# EAGLE schematic lesion-256 (EAGLE 8.3.2)
DESIGNER: JON NEWMAN; DESIGN_NAME: lesion-128-256; LICENSE: CERN OHL v1.2; REVISION: 1.0
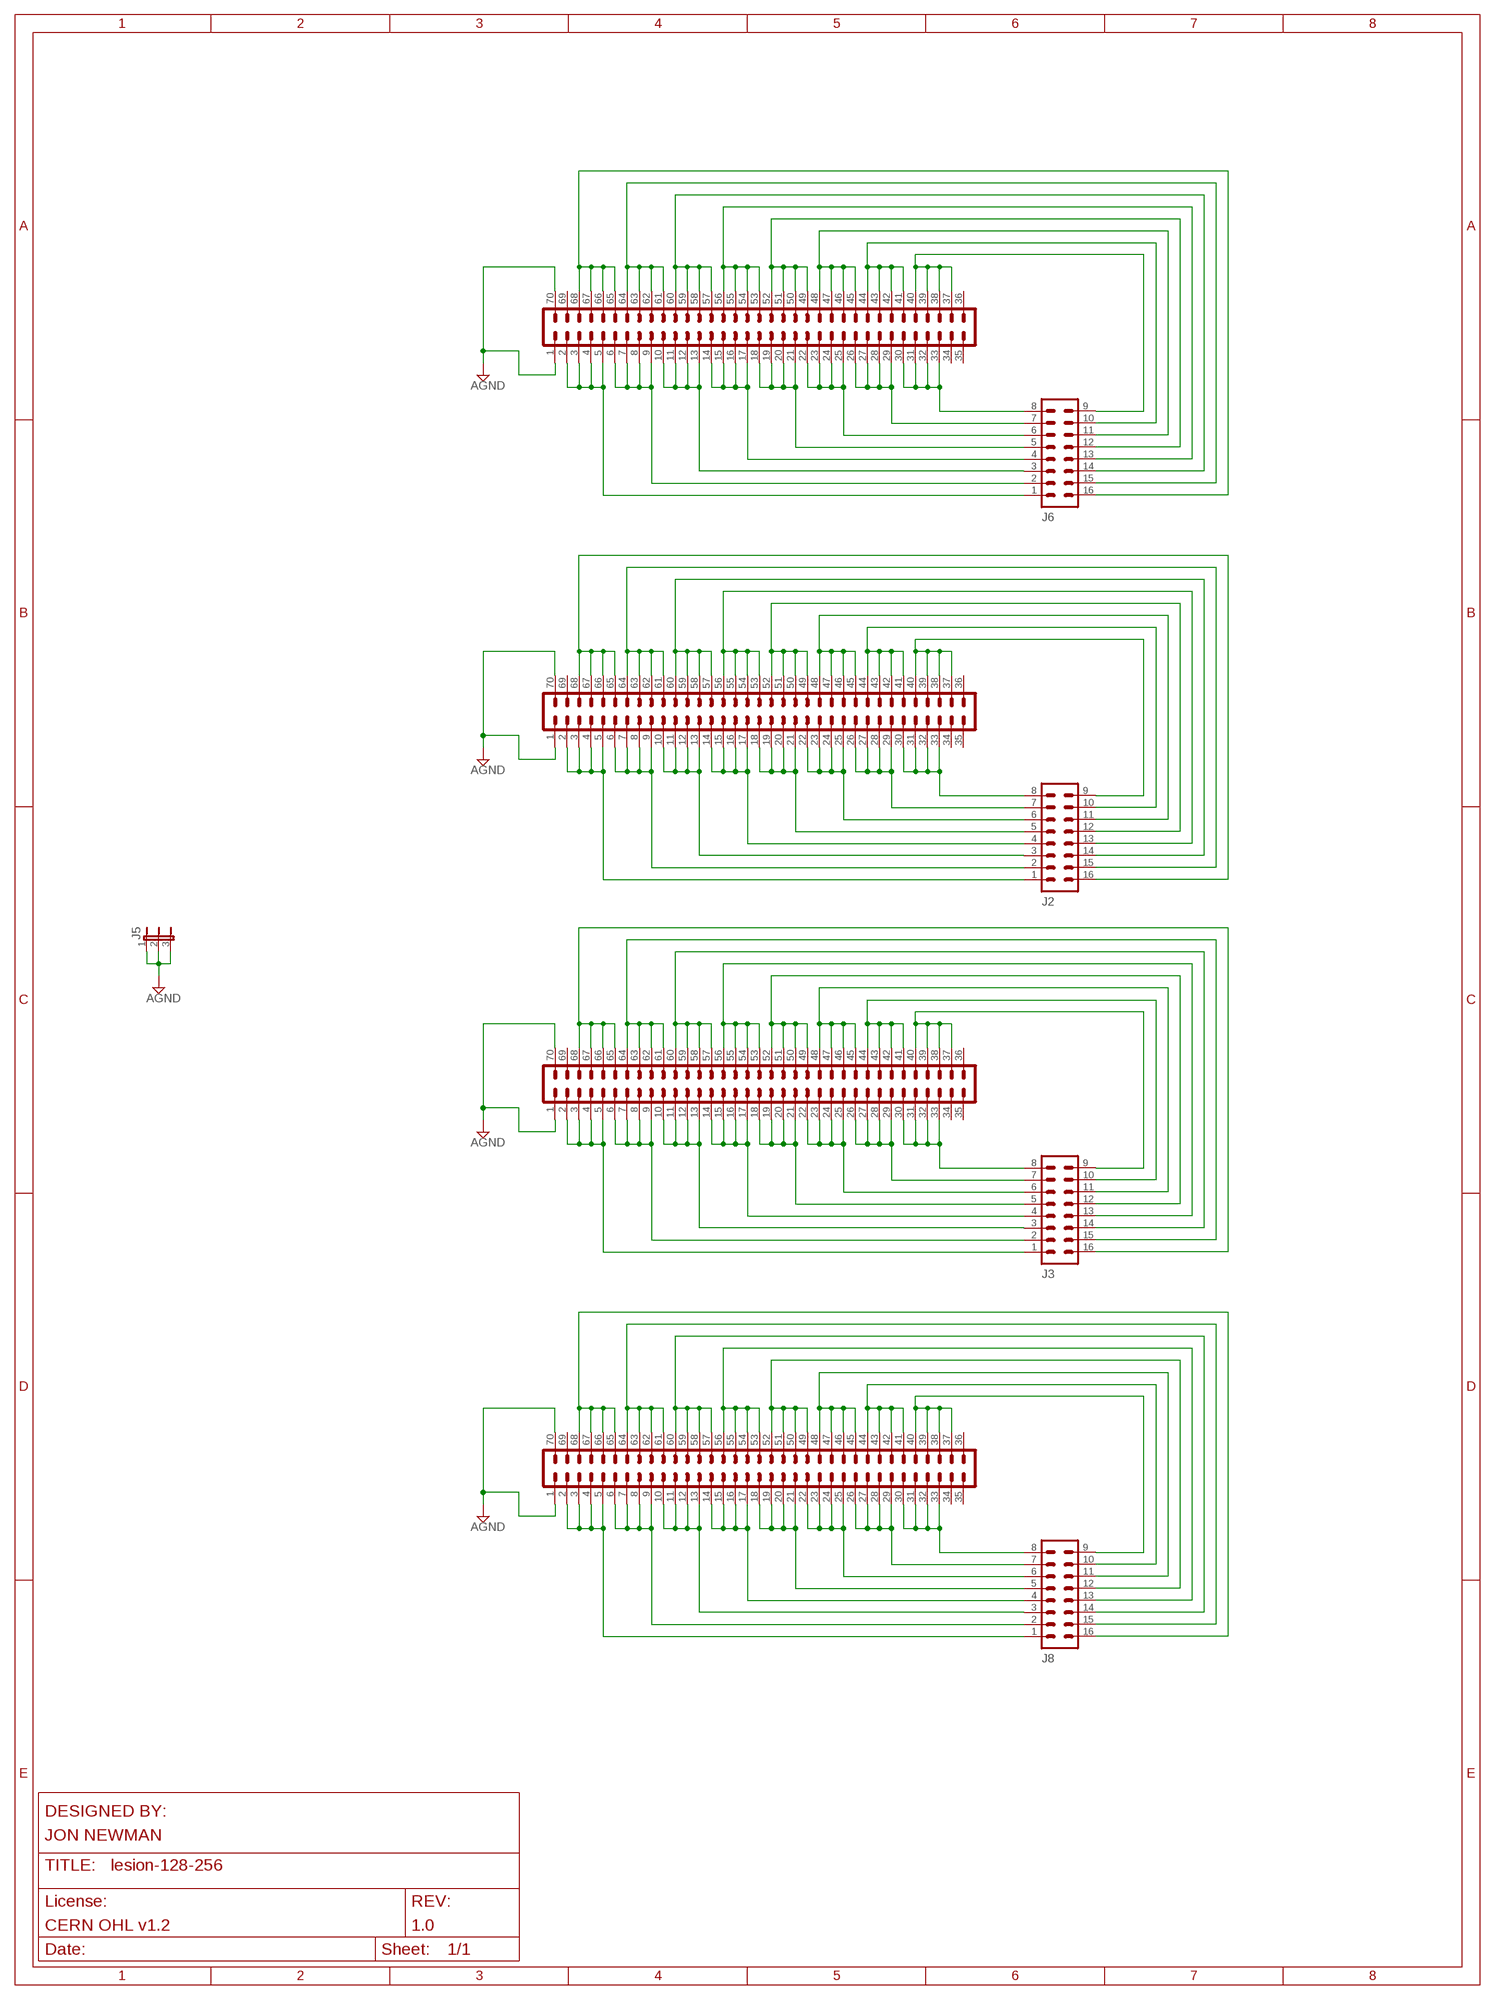
[diagram p0: schematic, sheet 1, part 1 of 2]
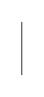
[diagram p1: schematic, sheet 1, part 2 of 2]

## Parts
J2  PINHD-2X8_SMD_0.5"  [JP2X8_SMD_0.5"]
J3  PINHD-2X8_SMD_0.5"  [JP2X8_SMD_0.5"]
J5  JP3E_SMD-0.05  [JP3_SMD-0.05]
J6  PINHD-2X8_SMD_0.5"  [JP2X8_SMD_0.5"]
J8  PINHD-2X8_SMD_0.5"  [JP2X8_SMD_0.5"]
JA1  DF40C(2.0)-70DS-0.4V(51)  PINHD-2X35_DF40REC  [DF40-70REC]
JA3  DF40C(2.0)-70DS-0.4V(51)  PINHD-2X35_DF40REC  [DF40-70REC]
JA5  DF40C(2.0)-70DS-0.4V(51)  PINHD-2X35_DF40REC  [DF40-70REC]
JA7  DF40C(2.0)-70DS-0.4V(51)  PINHD-2X35_DF40REC  [DF40-70REC]

## Nets
AGND: J5.1 J5.2 J5.3 JA1.1 JA1.70 JA3.1 JA3.70 JA5.1 JA5.70 JA7.1 JA7.70
N$16: J2.1 JA1.2 JA1.3 JA1.4 JA1.5
N$17: J2.2 JA1.6 JA1.7 JA1.8 JA1.9
N$18: J2.3 JA1.10 JA1.11 JA1.12 JA1.13
N$19: J2.4 JA1.14 JA1.15 JA1.16 JA1.17
N$20: J2.5 JA1.18 JA1.19 JA1.20 JA1.21
N$21: J2.6 JA1.22 JA1.23 JA1.24 JA1.25
N$22: J2.7 JA1.26 JA1.27 JA1.28 JA1.29
N$23: J2.8 JA1.30 JA1.31 JA1.32 JA1.33
N$24: J2.9 JA1.37 JA1.38 JA1.39 JA1.40
N$25: J2.10 JA1.41 JA1.42 JA1.43 JA1.44
N$26: J2.11 JA1.45 JA1.46 JA1.47 JA1.48
N$27: J2.12 JA1.49 JA1.50 JA1.51 JA1.52
N$28: J2.13 JA1.53 JA1.54 JA1.55 JA1.56
N$29: J2.14 JA1.57 JA1.58 JA1.59 JA1.60
N$30: J2.15 JA1.61 JA1.62 JA1.63 JA1.64
N$31: J2.16 JA1.65 JA1.66 JA1.67 JA1.68
N$33: J3.1 JA3.2 JA3.3 JA3.4 JA3.5
N$34: J3.2 JA3.6 JA3.7 JA3.8 JA3.9
N$35: J3.3 JA3.10 JA3.11 JA3.12 JA3.13
N$36: J3.4 JA3.14 JA3.15 JA3.16 JA3.17
N$37: J3.5 JA3.18 JA3.19 JA3.20 JA3.21
N$38: J3.6 JA3.22 JA3.23 JA3.24 JA3.25
N$39: J3.7 JA3.26 JA3.27 JA3.28 JA3.29
N$40: J3.8 JA3.30 JA3.31 JA3.32 JA3.33
N$41: J3.9 JA3.37 JA3.38 JA3.39 JA3.40
N$42: J3.10 JA3.41 JA3.42 JA3.43 JA3.44
N$43: J3.11 JA3.45 JA3.46 JA3.47 JA3.48
N$44: J3.12 JA3.49 JA3.50 JA3.51 JA3.52
N$45: J3.13 JA3.53 JA3.54 JA3.55 JA3.56
N$46: J3.14 JA3.57 JA3.58 JA3.59 JA3.60
N$47: J3.15 JA3.61 JA3.62 JA3.63 JA3.64
N$48: J3.16 JA3.65 JA3.66 JA3.67 JA3.68
N$65: J6.1 JA5.2 JA5.3 JA5.4 JA5.5
N$66: J6.2 JA5.6 JA5.7 JA5.8 JA5.9
N$67: J6.3 JA5.10 JA5.11 JA5.12 JA5.13
N$68: J6.4 JA5.14 JA5.15 JA5.16 JA5.17
N$69: J6.5 JA5.18 JA5.19 JA5.20 JA5.21
N$70: J6.6 JA5.22 JA5.23 JA5.24 JA5.25
N$71: J6.7 JA5.26 JA5.27 JA5.28 JA5.29
N$72: J6.8 JA5.30 JA5.31 JA5.32 JA5.33
N$73: J6.9 JA5.37 JA5.38 JA5.39 JA5.40
N$74: J6.10 JA5.41 JA5.42 JA5.43 JA5.44
N$75: J6.11 JA5.45 JA5.46 JA5.47 JA5.48
N$76: J6.12 JA5.49 JA5.50 JA5.51 JA5.52
N$77: J6.13 JA5.53 JA5.54 JA5.55 JA5.56
N$78: J6.14 JA5.57 JA5.58 JA5.59 JA5.60
N$79: J6.15 JA5.61 JA5.62 JA5.63 JA5.64
N$80: J6.16 JA5.65 JA5.66 JA5.67 JA5.68
N$97: J8.1 JA7.2 JA7.3 JA7.4 JA7.5
N$98: J8.2 JA7.6 JA7.7 JA7.8 JA7.9
N$99: J8.3 JA7.10 JA7.11 JA7.12 JA7.13
N$100: J8.4 JA7.14 JA7.15 JA7.16 JA7.17
N$101: J8.5 JA7.18 JA7.19 JA7.20 JA7.21
N$102: J8.6 JA7.22 JA7.23 JA7.24 JA7.25
N$103: J8.7 JA7.26 JA7.27 JA7.28 JA7.29
N$104: J8.8 JA7.30 JA7.31 JA7.32 JA7.33
N$105: J8.9 JA7.37 JA7.38 JA7.39 JA7.40
N$106: J8.10 JA7.41 JA7.42 JA7.43 JA7.44
N$107: J8.11 JA7.45 JA7.46 JA7.47 JA7.48
N$108: J8.12 JA7.49 JA7.50 JA7.51 JA7.52
N$109: J8.13 JA7.53 JA7.54 JA7.55 JA7.56
N$110: J8.14 JA7.57 JA7.58 JA7.59 JA7.60
N$111: J8.15 JA7.61 JA7.62 JA7.63 JA7.64
N$112: J8.16 JA7.65 JA7.66 JA7.67 JA7.68
Unconnected: JA1.34 JA1.35 JA1.36 JA1.69 JA3.34 JA3.35 JA3.36 JA3.69 JA5.34 JA5.35 JA5.36 JA5.69 JA7.34 JA7.35 JA7.36 JA7.69

## Library data of the parts
J2 J3 J6 J8 = jonnew:PINHD-2X8
J5 = jonnew:JP3E
JA1 JA3 JA5 JA7 = jonnew:PINHD-2X35

## Net classes
1 thick: width 0.102 mm